# Altium schematic sheet STRWL-S03-V00-CAN_MAIN.SchDoc
size A3; SheetNumber: 3; SheetTotal: 6
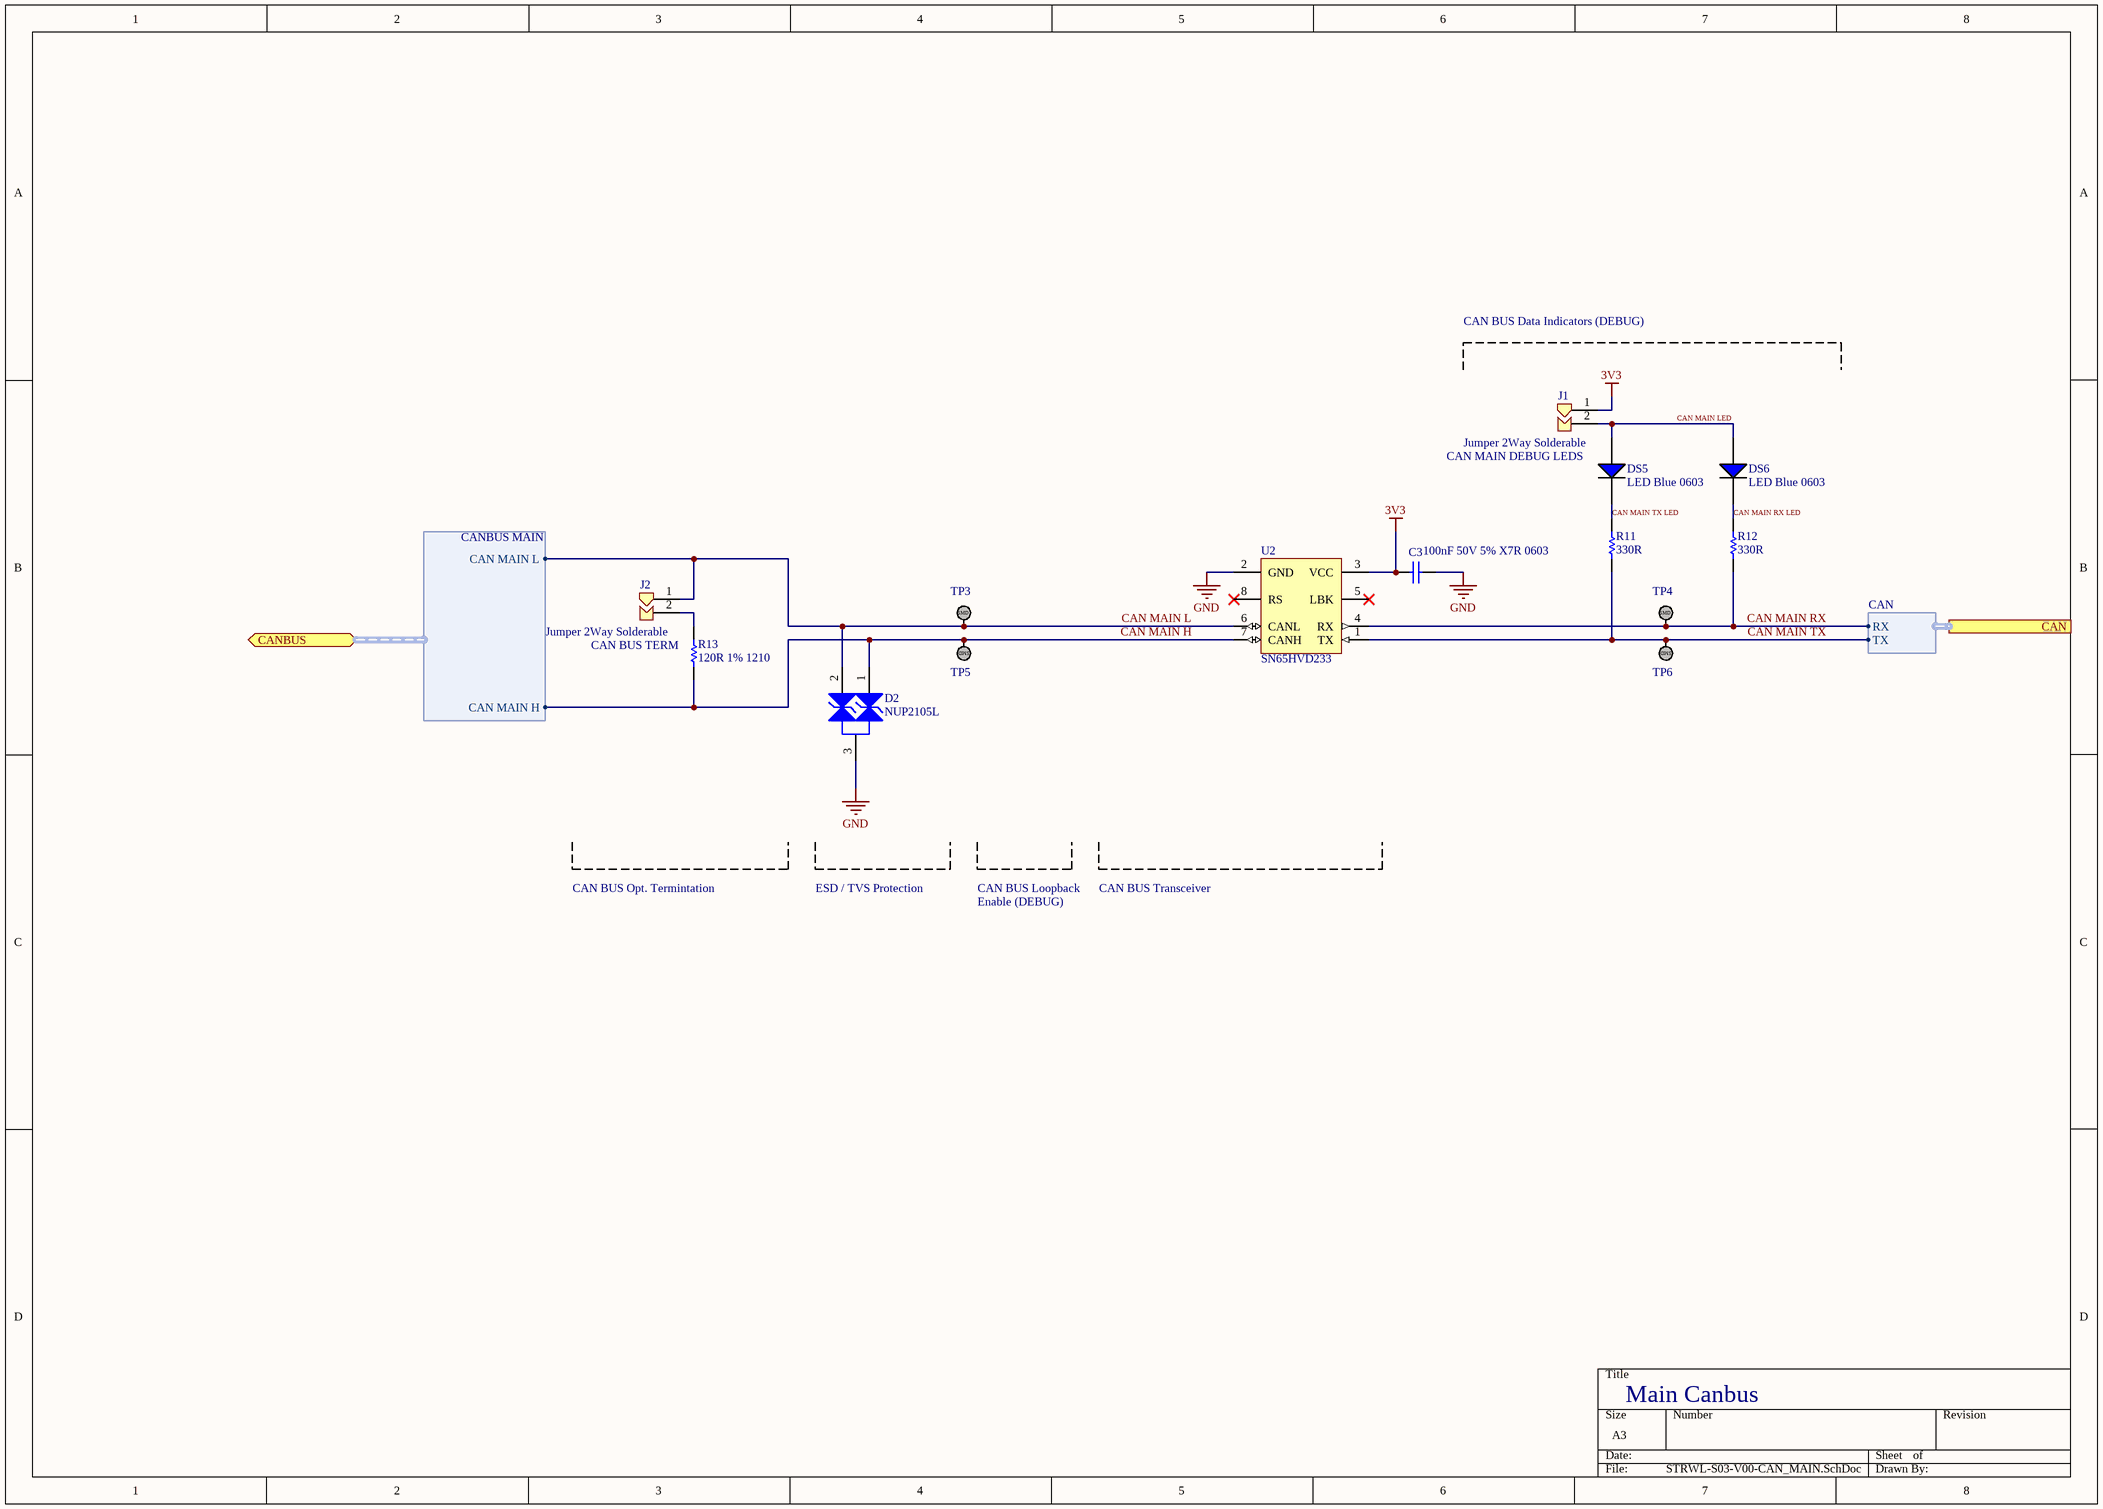
[diagram p0: STRWL-S03-V00-CAN_MAIN.SchDoc]

## Parts
C3  100nF 50V 5% X7R 0603  [Cap_Ceramic_0603]
D2  NUP2105L  [NUP2105L]
DS5  LED Blue 0603  [LED BLUE 0603]
DS6  LED Blue 0603  [LED BLUE 0603]
J1  Jumper 2Way Solderable  [Jumper_2Way_Solderable]
J2  Jumper 2Way Solderable  [Jumper_2Way_Solderable]
R11  330R  [Res_ThinFilm_0603]
R12  330R  [Res_ThinFilm_0603]
R13  120R 1% 1210  [Res_ThinFilm_1210]
TP3  TestPoint_SMD  [TestPointSMD]  (value not drawn)
TP4  TestPoint_SMD  [TestPointSMD]  (value not drawn)
TP5  TestPoint_SMD  [TestPointSMD]  (value not drawn)
TP6  TestPoint_SMD  [TestPointSMD]  (value not drawn)
U2  SN65HVD233  [SN65HVD233DR]

## Ports
CAN (harness CAN), CANBUS (bidir, harness CANBUS MAIN)

## Harnesses
CANBUS MAIN: CAN MAIN L, CAN MAIN H
CAN: TX, RX

## Nets
3V3: C3.1 J1.1 U2.3(VCC)
GND: C3.2 D2.3 U2.2(GND)
CAN MAIN H: D2.1 R13.1 TP5.1 U2.7(CANH) ; port CANBUS.CAN MAIN H
CAN MAIN L: D2.2 J2.1 TP3.1 U2.6(CANL) ; port CANBUS.CAN MAIN L
CAN MAIN LED: DS5.1(A) DS6.1(A) J1.2
CAN MAIN RX: R12.1 TP4.1 U2.4(RX) ; port CAN.RX
CAN MAIN RX LED: DS6.2(C) R12.2
CAN MAIN TX: R11.1 TP6.1 U2.1(TX) ; port CAN.TX
CAN MAIN TX LED: DS5.2(C) R11.2
NetJ2_2: J2.2 R13.2

Not connected (* = marked no-connect by the designer): U2 5(LBK)* 8(RS)*

## Notes on the sheet
- CAN BUS Data Indicators (DEBUG)
- CAN MAIN DEBUG LEDS
- (near R13) CAN BUS TERM
- CAN BUS Opt. Termintation
- ESD / TVS Protection
- CAN BUS Loopback
- Enable (DEBUG)
- CAN BUS Transceiver
- Main Canbus
- (in symbol TestPoint_SMD) SMD

## Library data of the parts
C3 = 100nF 50V 5% X7R 0603: Capacitor, Ceramic, SMD, 100nF, 50V, 5%, X7R, 0603
J1 J2 = Jumper 2Way Side Solderable
R11 R12 = 330R 5% 0603: Resistor, SMD, 330R, 0.1W, 5%, 0603
R13 = 120R 1% 1210: Resistor, SMD, 120R, 0.25W, 1%, 1210
D2 = NUP2105L: ComponentLink1Description: Datasheet; ComponentLink1URL: https://www.onsemi.cn/PowerSolutions/document/NUP2105L-D.PDF; Parameter 1: *; ComponentLink2Description: LCSC; ComponentLink2URL: https://lcsc.com/product-detail/TVS_ON-Semiconductor-NUP2105LT1G_C14486.html; ComponentLink3Description: Digikey; ComponentLink3URL: https://www.digikey.com.au/product-detail/en/on-semiconductor/SZNUP2105LT1G/SZNUP2105LT1GOSCT-ND/3487669
U2 = SN65HVD233: ComponentLink1Description: LCSC; ComponentLink1URL: https://lcsc.com/product-detail/CAN-ICs_Texas-Instruments_SN65HVD233DRG4_Texas-Instruments-Texas-Instruments-SN65HVD233DRG4_C61643.html; ComponentLink2Description: Digikey; ComponentLink2URL: https://www.digikey.com.au/product-detail/en/texas-instruments/SN65HVD233DR/296-35967-1-ND/4134960; ComponentLink3Description: Datasheet; ComponentLink3URL: https://www.ti.com/lit/ds/symlink/sn65hvd233.pdf?ts=1588560888178; ComponentLink4Description: Ti Product Page; ComponentLink4URL: https://www.ti.com/product/SN65HVD233